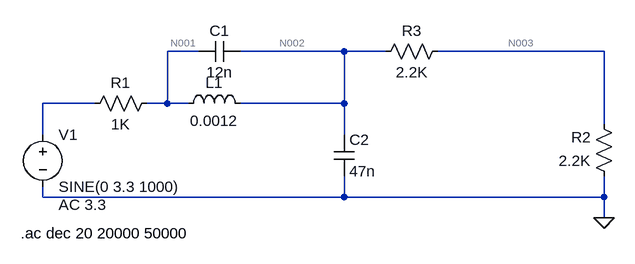
[diagram p0: schematic Draft1.asc]
Draft1.asc, the LTspice schematic file:
Version 4
SHEET 1 880 680
WIRE 208 32 160 32
WIRE 432 32 272 32
WIRE 496 32 432 32
WIRE 832 32 576 32
WIRE 48 112 -32 112
WIRE 160 112 160 32
WIRE 160 112 128 112
WIRE 192 112 160 112
WIRE 432 112 432 32
WIRE 432 112 272 112
WIRE 832 144 832 32
WIRE -32 160 -32 112
WIRE 432 160 432 112
WIRE -32 256 -32 240
WIRE 432 256 432 224
WIRE 432 256 -32 256
WIRE 832 256 832 224
WIRE 832 256 432 256
WIRE 832 288 832 256
FLAG 832 288 0
SYMBOL ind 176 128 R270
WINDOW 0 32 56 VTop 2
WINDOW 3 5 56 VBottom 2
SYMATTR InstName L1
SYMATTR Value 0.0012
SYMBOL res 144 96 R90
WINDOW 0 0 56 VBottom 2
WINDOW 3 32 56 VTop 2
SYMATTR InstName R1
SYMATTR Value 1K
SYMBOL res 848 240 R180
WINDOW 0 36 76 Left 2
WINDOW 3 36 40 Left 2
SYMATTR InstName R2
SYMATTR Value 2.2K
SYMBOL cap 272 16 R90
WINDOW 0 0 32 VBottom 2
WINDOW 3 32 32 VTop 2
SYMATTR InstName C1
SYMATTR Value 12n
SYMBOL voltage -32 144 R0
WINDOW 123 24 124 Left 2
WINDOW 39 0 0 Left 0
SYMATTR InstName V1
SYMATTR Value SINE(0 3.3 1000)
SYMATTR Value2 AC 3.3
SYMBOL cap 416 160 R0
SYMATTR InstName C2
SYMATTR Value 47n
SYMBOL res 592 16 R90
WINDOW 0 0 56 VBottom 2
WINDOW 3 32 56 VTop 2
SYMATTR InstName R3
SYMATTR Value 2.2K
TEXT -66 312 Left 2 !.ac dec 20 20000 50000

The netlist it stands for:
* Draft1.asc
L1 N001 N002 0.0012
R1 N001 N004 1K
R2 0 N003 2.2K
C1 N002 N001 12n
V1 N004 0 SINE(0 3.3 1000) AC 3.3
C2 N002 0 47n
R3 N003 N002 2.2K
.ac dec 20 20000 50000
.backanno
.end

* Results of the author's LTspice run, read from the files saved beside the schematic
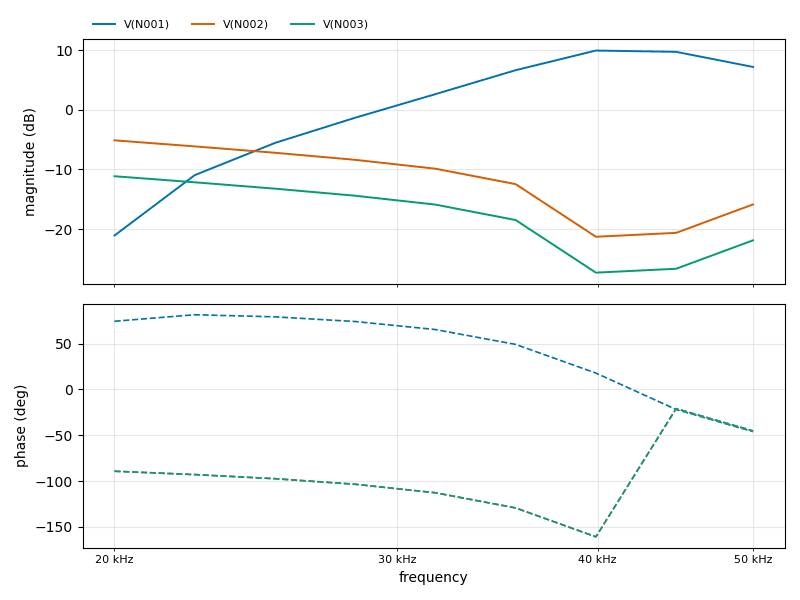
[diagram p1: AC Analysis of Draft1.asc, plotted from the saved traces]
* AC Analysis, 1 run:
*   V(N001): -21.09 dB at 20 kHz, 7.19 dB at 50 kHz, peak 9.94 dB at 39.91 kHz, 3 dB below the peak at 35.92 kHz
*   V(N002): -5.12 dB at 20 kHz, -15.87 dB at 50 kHz, peak -5.12 dB at 20 kHz, 3 dB below the peak at 27.55 kHz
*   V(N003): -11.14 dB at 20 kHz, -21.89 dB at 50 kHz, peak -11.14 dB at 20 kHz, 3 dB below the peak at 27.55 kHz